# Altium schematic sheet 06-光敏传感器模块-原理图.SchDoc
size A4
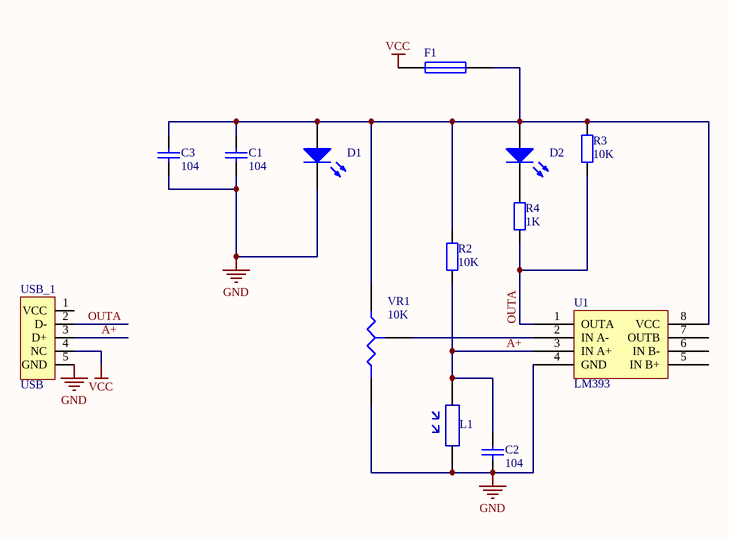
[diagram p0: 06-光敏传感器模块-原理图.SchDoc]

## Parts
C1  value 104  [0805]  (hidden comment: Cap Semi)
C2  value 104  [0805]  (hidden comment: Cap Semi)
C3  value 104  [0805]  (hidden comment: Cap Semi)
D1  LED0  [0805]  (value not drawn)
D2  LED0  [0805]  (value not drawn)
F1  Fuse 1  [Fuse]  (value not drawn)
L1  light_resistor  [light]  (value not drawn)
R2  value 10K  [0805]  (hidden comment: Res2)
R3  value 10K  [0805]  (hidden comment: Res2)
R4  value 1K  [0805]  (hidden comment: Res2)
U1  LM393  [SOP-8]
USB_1  USB  [USB/SM0.8-6H5]
VR1  value 10K  [VR]  (hidden comment: Res Tap)

## Nets
GND: C1.1 C2.1 C3.1 D1.2(K) L1.2 U1.4(GND) USB_1.5(GND) VR1.2(B)
VCC: F1.2 USB_1.4(NC)
A+: C2.2 L1.1 R2.1 U1.3(IN_A+) USB_1.3(D+)
OUTA: R3.1 R4.1 U1.1(OUTA) USB_1.2(D-)
NetC1_2: C1.2 C3.2 D1.1(A) D2.1(A) F1.1 R2.2 R3.2 U1.8(VCC) VR1.1(A)
NetD2_2: D2.2(K) R4.2
NetU1_2: U1.2(IN_A-) VR1.3(TAP)

Not connected (* = marked no-connect by the designer): U1 5(IN_B+) 6(IN_B-) 7(OUTB); USB_1 1(VCC)

## Library data of the parts
C1-C3 = Cap Semi: Capacitor (Semiconductor SIM Model); Published: 8-Jun-2000; LatestRevisionDate: 29-May-2009; LatestRevisionNote: IPC-7351 Footprint Added.; PackageReference: C1206; Publisher: Altium Limited; PackageDescription: Chip Capacitor
D1 D2 = LED0: Typical INFRARED GaAs LED; Published: 8-Jun-2000; LatestRevisionDate: 08-Jul-2005; LatestRevisionNote: Mech Layer 1 removed.; PackageReference: LED-0; Publisher: Altium Limited; PackageDescription: LED; 2 Leads
F1 = Fuse 1: Fuse; Published: 8-Jun-2000; LatestRevisionDate: 17-Jul-2002; LatestRevisionNote: Re-released for DXP Platform.; PackageReference: PIN-W2/E2.8; Publisher: Altium Limited; PackageDescription: Thru-Hole; 2 Leads
L1 = light
R2-R4 = Res2: Resistor; Published: 8-Jun-2000; LatestRevisionDate: 17-Jul-2002; LatestRevisionNote: Re-released for DXP Platform.; PackageReference: AXIAL-0.4; Publisher: Altium Limited; PackageDescription: Axial Device, Thru-Hole; 2 Leads; 0.4 in Pin Spacing
USB_1 = USB5
VR1 = Res Tap: Tapped Resistor; Sim Note: Enter the Resistance value and the set point into parameter fields.; Set Position: 0.5; Published: 24-Mar-1999; LatestRevisionDate: 17-Jul-2002; LatestRevisionNote: Re-released for DXP Platform.; PackageReference: VR3; Publisher: Altium Limited; PackageDescription: Variable Resistor, Thru-Hole; 3 Leads